# Altium schematic sheet 04_SDRAM.SchDoc: =GlobalProjectName
size 594 x 420 mm; ApprovedBy: Галкин; CheckedBy: Галкин; Author: Данич; SheetNumber: 4; SheetTotal: 8; PageSetup: Record=PageOptions|CenterHorizontal=True|CenterVertical=True|PrintScale=0.70|XCorrection=1.00|YCorrection=1.00|PrintKind=2|BorderSize=5000000|LeftOffset=9000|BottomOffset=10100|Orientation=2|PaperLength=11176|PaperWidth=8636|Scale=100|PaperSource=259|PrintQuality=-3|MediaType=1|DitherType=10|PrintScaleMode=1|PaperKind=A3|PaperIndex=8
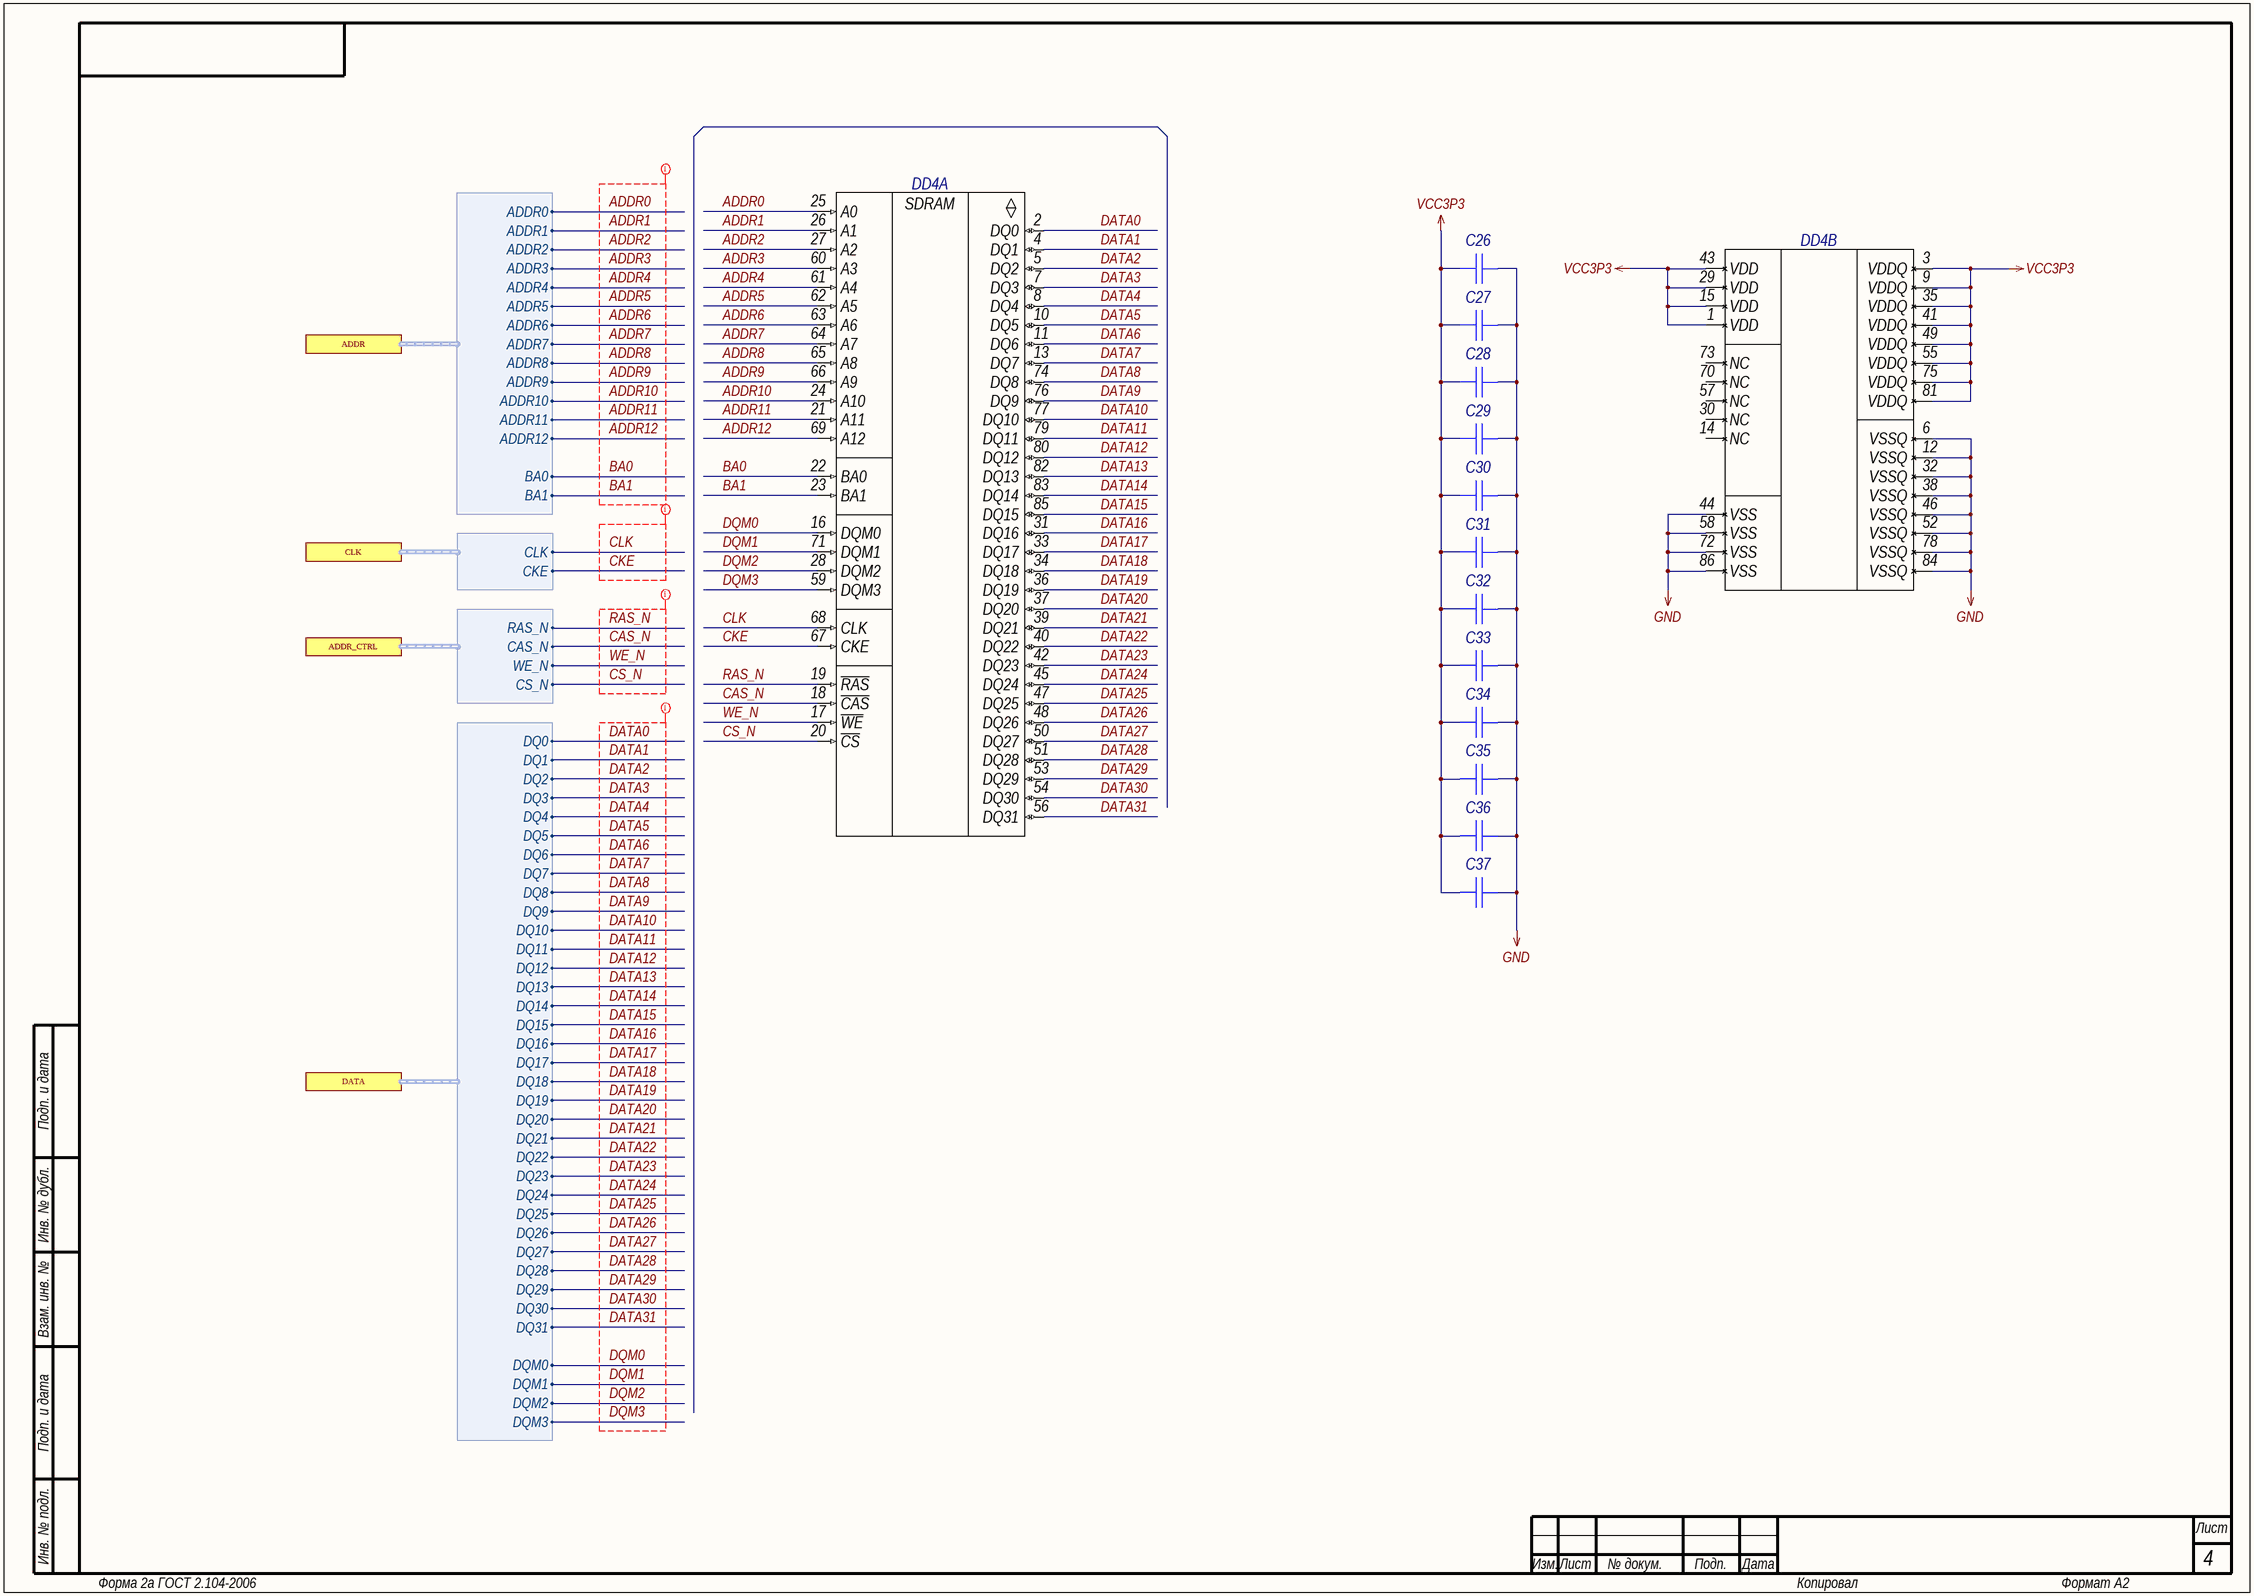
[diagram p0: 04_SDRAM.SchDoc]

## Parts
C26  Capacitor  [C0402_L]  (value not drawn)
C27  Capacitor  [C0402_L]  (value not drawn)
C28  Capacitor  [C0402_L]  (value not drawn)
C29  Capacitor  [C0402_L]  (value not drawn)
C30  Capacitor  [C0402_L]  (value not drawn)
C31  Capacitor  [C0402_L]  (value not drawn)
C32  Capacitor  [C0402_L]  (value not drawn)
C33  Capacitor  [C0402_L]  (value not drawn)
C34  Capacitor  [C0402_L]  (value not drawn)
C35  Capacitor  [C0402_L]  (value not drawn)
C36  Capacitor  [C0402_L]  (value not drawn)
C37  Capacitor  [C0402_L]  (value not drawn)
DD4  IS4xS32160F-xTxx-Series  [TSOP2-86_050P2222X1016X125_N]  (value not drawn)  (parts A,B of 2)

## Ports
ADDR (harness SDRAM_ADDR), ADDR_CTRL (harness SDRAM_ADDR_CTRL), CLK (harness SDRAM_CLK), DATA (harness SDRAM_DQ)

## Harnesses
SDRAM_ADDR: BA0, BA1, ADDR12, ADDR11, ADDR10, ADDR9, ADDR8, ADDR7, ADDR6, ADDR5, ADDR4, ADDR3, ADDR2, ADDR1, ADDR0
SDRAM_ADDR_CTRL: RAS_N, CAS_N, WE_N, CS_N
SDRAM_CLK: CLK, CKE
SDRAM_DQ: DQ0, DQ1, DQ2, DQ3, DQ4, DQ5, DQ6, DQ7, DQ8, DQ9, DQ10, DQ11, DQ12, DQ13, DQ14, DQ15, DQ16, DQ17, DQ18, DQ19, DQ20, DQ21, DQ22, DQ23, DQ24, DQ25, DQ26, DQ27, DQ28, DQ29, DQ30, DQ31, DQM0, DQM1, DQM2, DQM3

## Nets
GND: C26.2 C27.2 C28.2 C29.2 C30.2 C31.2 C32.2 C33.2 C34.2 C35.2 C36.2 C37.2 DD4.6(VSSQ) DD4.12(VSSQ) DD4.32(VSSQ) DD4.38(VSSQ) DD4.44(VSS) DD4.46(VSSQ) DD4.52(VSSQ) DD4.58(VSS) DD4.72(VSS) DD4.78(VSSQ) DD4.84(VSSQ) DD4.86(VSS)
VCC3P3: C26.1 C27.1 C28.1 C29.1 C30.1 C31.1 C32.1 C33.1 C34.1 C35.1 C36.1 C37.1 DD4.1(VDD) DD4.3(VDDQ) DD4.9(VDDQ) DD4.15(VDD) DD4.29(VDD) DD4.35(VDDQ) DD4.41(VDDQ) DD4.43(VDD) DD4.49(VDDQ) DD4.55(VDDQ) DD4.75(VDDQ) DD4.81(VDDQ)
ADDR0: DD4.25(A0) ; port ADDR.ADDR0
ADDR1: DD4.26(A1) ; port ADDR.ADDR1
ADDR2: DD4.27(A2) ; port ADDR.ADDR2
ADDR3: DD4.60(A3) ; port ADDR.ADDR3
ADDR4: DD4.61(A4) ; port ADDR.ADDR4
ADDR5: DD4.62(A5) ; port ADDR.ADDR5
ADDR6: DD4.63(A6) ; port ADDR.ADDR6
ADDR7: DD4.64(A7) ; port ADDR.ADDR7
ADDR8: DD4.65(A8) ; port ADDR.ADDR8
ADDR9: DD4.66(A9) ; port ADDR.ADDR9
ADDR10: DD4.24(A10) ; port ADDR.ADDR10
ADDR11: DD4.21(A11) ; port ADDR.ADDR11
ADDR12: DD4.69(A12) ; port ADDR.ADDR12
BA0: DD4.22(BA0) ; port ADDR.BA0
BA1: DD4.23(BA1) ; port ADDR.BA1
CAS_N: DD4.18(~{CAS}) ; port ADDR_CTRL.CAS_N
CKE: DD4.67(CKE) ; port CLK.CKE
CLK: DD4.68(CLK) ; port CLK.CLK
CS_N: DD4.20(~{CS}) ; port ADDR_CTRL.CS_N
DATA0: DD4.2(DQ0) ; port DATA.DQ0
DATA1: DD4.4(DQ1) ; port DATA.DQ1
DATA2: DD4.5(DQ2) ; port DATA.DQ2
DATA3: DD4.7(DQ3) ; port DATA.DQ3
DATA4: DD4.8(DQ4) ; port DATA.DQ4
DATA5: DD4.10(DQ5) ; port DATA.DQ5
DATA6: DD4.11(DQ6) ; port DATA.DQ6
DATA7: DD4.13(DQ7) ; port DATA.DQ7
DATA8: DD4.74(DQ8) ; port DATA.DQ8
DATA9: DD4.76(DQ9) ; port DATA.DQ9
DATA10: DD4.77(DQ10) ; port DATA.DQ10
DATA11: DD4.79(DQ11) ; port DATA.DQ11
DATA12: DD4.80(DQ12) ; port DATA.DQ12
DATA13: DD4.82(DQ13) ; port DATA.DQ13
DATA14: DD4.83(DQ14) ; port DATA.DQ14
DATA15: DD4.85(DQ15) ; port DATA.DQ15
DATA16: DD4.31(DQ16) ; port DATA.DQ16
DATA17: DD4.33(DQ17) ; port DATA.DQ17
DATA18: DD4.34(DQ18) ; port DATA.DQ18
DATA19: DD4.36(DQ19) ; port DATA.DQ19
DATA20: DD4.37(DQ20) ; port DATA.DQ20
DATA21: DD4.39(DQ21) ; port DATA.DQ21
DATA22: DD4.40(DQ22) ; port DATA.DQ22
DATA23: DD4.42(DQ23) ; port DATA.DQ23
DATA24: DD4.45(DQ24) ; port DATA.DQ24
DATA25: DD4.47(DQ25) ; port DATA.DQ25
DATA26: DD4.48(DQ26) ; port DATA.DQ26
DATA27: DD4.50(DQ27) ; port DATA.DQ27
DATA28: DD4.51(DQ28) ; port DATA.DQ28
DATA29: DD4.53(DQ29) ; port DATA.DQ29
DATA30: DD4.54(DQ30) ; port DATA.DQ30
DATA31: DD4.56(DQ31) ; port DATA.DQ31
DQM0: DD4.16(DQM0) ; port DATA.DQM0
DQM1: DD4.71(DQM1) ; port DATA.DQM1
DQM2: DD4.28(DQM2) ; port DATA.DQM2
DQM3: DD4.59(DQM3) ; port DATA.DQM3
RAS_N: DD4.19(~{RAS}) ; port ADDR_CTRL.RAS_N
WE_N: DD4.17(~{WE}) ; port ADDR_CTRL.WE_N

Not connected (* = marked no-connect by the designer): DD4 14(NC) 30(NC) 57(NC) 70(NC) 73(NC)

## Layout directives
net class SDRAM_ADDR: ADDR0, ADDR1, ADDR2, ADDR3, ADDR4, ADDR5, ADDR6, ADDR7, ADDR8, ADDR9, ADDR10, ADDR11, ADDR12, BA0, BA1
net class SDRAM_CLK; net class SDRAM_CTRL: CKE, CLK
net class SDRAM_CTRL: CAS_N, CS_N, RAS_N, WE_N
net class SDRAM_DATA: DATA0, DATA1, DATA2, DATA3, DATA4, DATA5, DATA6, DATA7, DATA8, DATA9, DATA10, DATA11, DATA12, DATA13, DATA14, DATA15, DATA16, DATA17, DATA18, DATA19, DATA20, DATA21, DATA22, DATA23, DATA24, DATA25, DATA26, DATA27, DATA28, DATA29, DATA30, DATA31, DQM0, DQM1, DQM2, DQM3

## Notes on the sheet
- Подп. и дата
- Инв. № дубл.
- Взам. инв. №
- Инв. № подл.
- Изм.
- Лист
- № докум.
- Подп.
- Дата
- Форма 2а ГОСТ 2.104-2006
- Копировал
- Формат А2
- (in symbol IS42S32160F-7TLI, part A) SDRAM

## Library data of the parts
C26 C27 = GRM155R60J106ME15D: Manufacturer: Murata; Type: Конденсатор; Schematic Value: 10uF, 6.3V, X5R; ID: 234; Value: 10uF; Voltage: 6.3V; Tolerance: ±20%; Dielectric Type: X5R; Application Category: 1; Working Temperature Min: -55°С; Working Temperature Max: +85°С; Published: 18.05.2010; Publisher: Andrew Danich; Part Number: GRM155R60J106ME15D; Footprint: 0402
C28-C31 = GCM155R71C104KA55D: Manufacturer: Murata; Type: Конденсатор; Schematic Value: 0.1uF, 16V, X7R; ID: 163; Value: 0.1uF; Voltage: 16V; Tolerance: ±10%; Dielectric Type: X7R; Application Category: 1; Working Temperature Min: -55°С; Working Temperature Max: +125°С; Functional Analog: GRM155R71C104KA88D; Published: 18.05.2010; Publisher: Andrew Danich; Part Number: GCM155R71C104KA55D; Footprint: 0402
C32-C37 = GCM155R71E103KA37D: Manufacturer: Murata; Type: Конденсатор; Schematic Value: 0.01uF, 25V, X7R; ID: 150; Value: 0.01uF; Voltage: 25V; Tolerance: ±10%; Dielectric Type: X7R; Application Category: 1; Working Temperature Min: -55°С; Working Temperature Max: +125°С; Functional Analog: GRM155R71E103KA01D; Published: 18.05.2010; Publisher: Andrew Danich; Part Number: GCM155R71E103KA37D; Footprint: 0402
DD4 = IS42S32160F-7TLI: Manufacturer: ISSI; ID: 6; Supply Operation: +3.0…3.6V; Supply Current: 140mA; Memory: 16M*32; Addressable: Yes; Interface: Parallel; Clock Frequency: 167MHz; Application Category: 1; Working Temperature Min: -40°С; Working Temperature Max: +85°С; Type: Микросхема; Published: 20.05.2020; Publisher: Andrew Danich; Part Number: IS42S32160F-7TLI; Value: IS42S32160F-7TLI